# EAGLE design sensor-sm (EAGLE 6.1)
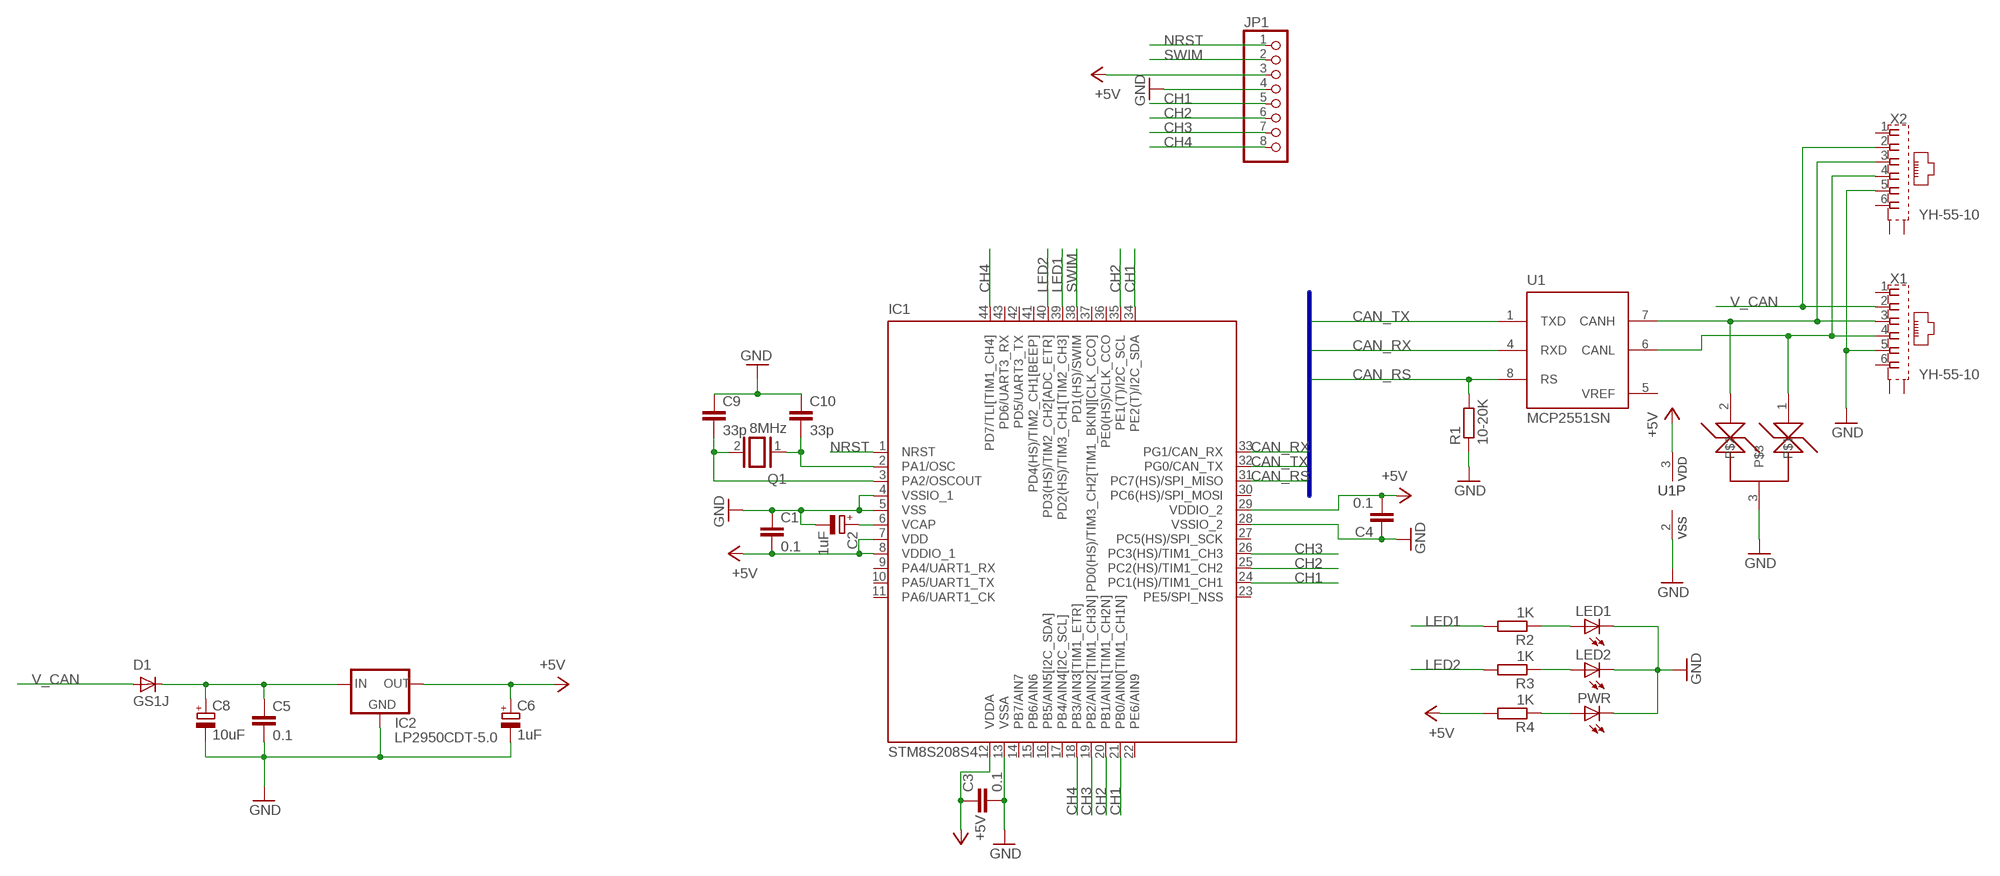
[diagram p0: schematic, sheet 1]

## Parts
C1  0.1  C-EUC0805K  [C0805K]
C2  1uF  CPOL-EUE2-4  [E2-4]
C3  0.1  C-EUC0805K  [C0805K]
C4  0.1  C-EUC0805K  [C0805K]
C5  0.1  C-EUC0805K  [C0805K]
C6  1uF  CPOL-EUE2-4  [E2-4]
C8  10uF  CPOL-EUE2-4  [E2-4]
C9  33p  C-EUC0805K  [C0805K]
C10  33p  C-EUC0805K  [C0805K]
D1  GS1J  GF1  [SMA-DO214AC]
IC1  STM8S208S4  [LQFP44-10X10]
IC2  LP2950CDT-5.0  [DPACK]
JP1  PINHD-1X8/90  [1X08/90]
LED1  LEDSML1206  [SML1206]
LED2  LEDSML1206  [SML1206]
NUP2105L  NUP2105L  [SOT23]
PWR  LEDSML1206  [SML1206]
Q1  8MHz  XTAL/S  [QS]
R1  10-20K  R-EU_R0805  [R0805]
R2  1K  R-EU_R0805  [R0805]
R3  1K  R-EU_R0805  [R0805]
R4  1K  R-EU_R0805  [R0805]
U1  MCP2551SN  [SO-08]
X1  YH-55-10  [YH-55-10]
X2  YH-55-10  [YH-55-10]

## Nets
+5V: C1.2 C3.1 C4.2 C6.+ IC1.7(VDD) IC1.8(VDDIO_1) IC1.12(VDDA) IC1.29(VDDIO_2) IC2.3(OUT) JP1.3 R4.2 U1.3(VDD)
CAN_RS: IC1.31(PC7(HS)/SPI_MISO) R1.2 U1.8(RS)
CAN_RX: IC1.33(PG1/CAN_RX) U1.4(RXD)
CAN_TX: IC1.32(PG0/CAN_TX) U1.1(TXD)
CH1: IC1.21(PB0/AIN0[TIM1_CH1N]) IC1.24(PC1(HS)/TIM1_CH1) IC1.34(PE2(T)/I2C_SDA) JP1.5
CH2: IC1.20(PB1/AIN1[TIM1_CH2N]) IC1.25(PC2(HS)/TIM1_CH2) IC1.35(PE1(T)/I2C_SCL) JP1.6
CH3: IC1.19(PB2/AIN2[TIM1_CH3N]) IC1.26(PC3(HS)/TIM1_CH3) JP1.7
CH4: IC1.18(PB3/AIN3[TIM1_ETR]) IC1.44(PD7/TLI[TIM1_CH4]) JP1.8
GND: C1.1 C2.- C3.2 C4.1 C5.2 C6.- C8.- C9.1 C10.1 IC1.4(VSSIO_1) IC1.5(VSS) IC1.13(VSSA) IC1.28(VSSIO_2) IC2.4(GND) JP1.4 LED1.C LED2.C NUP2105L.3 PWR.C R1.1 U1.2(VSS) X1.5 X2.5
LED1: IC1.39(PD2(HS)/TIM3_CH1[TIM2_CH3]) R2.2
LED2: IC1.40(PD3(HS)/TIM2_CH2[ADC_ETR]) R3.2
N$1: C2.+ IC1.6(VCAP)
N$3: C10.2 IC1.2(PA1/OSC) Q1.1
N$4: NUP2105L.1 U1.6(CANL) X1.4 X2.4
N$5: C9.2 IC1.3(PA2/OSCOUT) Q1.2
N$6: LED1.A R2.1
N$7: LED2.A R3.1
N$8: PWR.A R4.1
N$9: NUP2105L.2 U1.7(CANH) X1.3 X2.3
N$10: C5.1 C8.+ D1.K(C) IC2.1(IN)
NRST: IC1.1(NRST) JP1.1
SWIM: IC1.38(PD1(HS)/SWIM) JP1.2
V_CAN: D1.A X1.2 X2.2
Unconnected: IC1.9(PA4/UART1_RX) IC1.10(PA5/UART1_TX) IC1.11(PA6/UART1_CK) IC1.14(PB7/AIN7) IC1.15(PB6/AIN6) IC1.16(PB5/AIN5[I2C_SDA]) IC1.17(PB4/AIN4[I2C_SCL]) IC1.22(PE6/AIN9) IC1.23(PE5/SPI_NSS) IC1.27(PC5(HS)/SPI_SCK) IC1.30(PC6(HS)/SPI_MOSI) IC1.36(PE0(HS)/CLK_CCO) IC1.37(PD0(HS)/TIM3_CH2[TIM1_BKIN][CLK_CCO]) IC1.41(PD4(HS)/TIM2_CH1[BEEP]) IC1.42(PD5/UART3_TX) IC1.43(PD6/UART3_RX) X1.1 X1.6 X1.S1(S) X1.S2(S) X2.1 X2.6 X2.S1(S) X2.S2(S)

## Buses
CAN_TX,CAN_RX,CAN_RS

## Power pins joined to a net without a drawn wire
VREF: U1.5(VREF)

## Library data of the parts
C1 C3-C5 C9 C10 = rcl:C-EU: CAPACITOR, European symbol
C2 C6 C8 = rcl:CPOL-EU: POLARIZED CAPACITOR, European symbol
D1 = diode:GF1: DIODE
IC1 = stm8s208s:STM8S208S: Access line, 16 MHz STM8S 8-bit MCU up to 32 Kbytes Flash, integrated EEPROM,10-bit ADC, timers, UART, SPI, I²C Source: Data sheet <http://www.st.com/stonline/products/literature/ds/14771/stm8s105c4.pdf>; MPN: STM8S208S; OC_FARNELL: 1706227; OC_NEWARK: 09R6037
IC2 = v-reg:LP2950?*: Source: http://cache.national.com/ds/LP/LP2950.pdf
JP1 = pinhead:PINHD-1X8: PIN HEADER
LED1 LED2 PWR = led:LED: LED OSRAM: - CHIPLED LG R971, LG N971, LY N971, LG Q971, LY Q971, LO R971, LY R971 LH N974, LH R974 LS Q976, LO Q976, LY Q976 LO Q996 - Hyper CHIPLED LW Q18S LB Q993, LB Q99A, LB R99A - SideLED LS A670, LO A670, LY A670, LG A670, LP A670 LB A673, LV A673, LT A673, LW A673 LH A674 LY A675 LS A676, LA A676, LO A676, LY A676, LW A676 LS A679, LY A679, LG A679 - Hyper Micro SIDELED® LS Y876, LA Y876, LO Y876, LY Y876 LT Y87S - SmartLED LW L88C, LW L88S LB L89C, LB L89S, LG L890 LS L89K, LO L89K, LY L89K LS L896, LA L896, LO L896, LY L896 - TOPLED LS T670, LO T670, LY T670, LG T670, LP T670 LSG T670, LSP T670, LSY T670, LOP T670, LYG T670 LG T671, LOG T671, LSG T671 LB T673, LV T673, LT T673, LW T673 LH T674 LS T676, LA T676, LO T676, LY T676, LB T676, LH T676, LSB T676, LW T676 LB T67C, LV T67C, LT T67C, LS T67K, LO T67K, LY T67K, LW E67C LS E67B, LA E67B, LO E67B, LY E67B, LB E67C, LV E67C, LT E67C LW T67C LS T679, LY T679, LG T679 LS T770, LO T770, LY T770, LG T770, LP T770 LB T773, LV T773, LT T773, LW T773 LH T774 LS E675, LA E675, LY E675, LS T675 LS T776, LA T776, LO T776, LY T776, LB T776 LHGB T686 LT T68C, LB T68C - Hyper Mini TOPLED® LB M676 - Mini TOPLED Santana® LG M470 LS M47K, LO M47K, LY M47K Source: http://www.osram.convergy.de LUXEON: - LUMILED® LXK2-PW12-R00, LXK2-PW12-S00, LXK2-PW14-U00, LXK2-PW14-V00 LXK2-PM12-R00, LXK2-PM12-S00, LXK2-PM14-U00 LXK2-PE12-Q00, LXK2-PE12-R00, LXK2-PE12-S00, LXK2-PE14-T00, LXK2-PE14-U00 LXK2-PB12-K00, LXK2-PB12-L00, LXK2-PB12-M00, LXK2-PB14-N00, LXK2-PB14-P00, LXK2-PB14-Q00 LXK2-PR12-L00, LXK2-PR12-M00, LXK2-PR14-Q00, LXK2-PR14-R00 LXK2-PD12-Q00, LXK2-PD12-R00, LXK2-PD12-S00 LXK2-PH12-R00, LXK2-PH12-S00 LXK2-PL12-P00, LXK2-PL12-Q00, LXK2-PL12-R00 Source: www.luxeon.com KINGBRIGHT: KA-3528ASYC Source: www.kingbright.com
NUP2105L = transistor:NUP2105L
Q1 = special:XTAL/S: CRYSTAL
R1-R4 = rcl:R-EU_: RESISTOR, European symbol
U1 = microchip_can:MCP2551: High Speed CAN tranceiver
X1 X2 = con-wenzhou-yihua:YH-55-10: RJ11 6 connects Source: YH-55-10.pdf; OC_FARNELL: unknown; OC_NEWARK: unknown

## Board
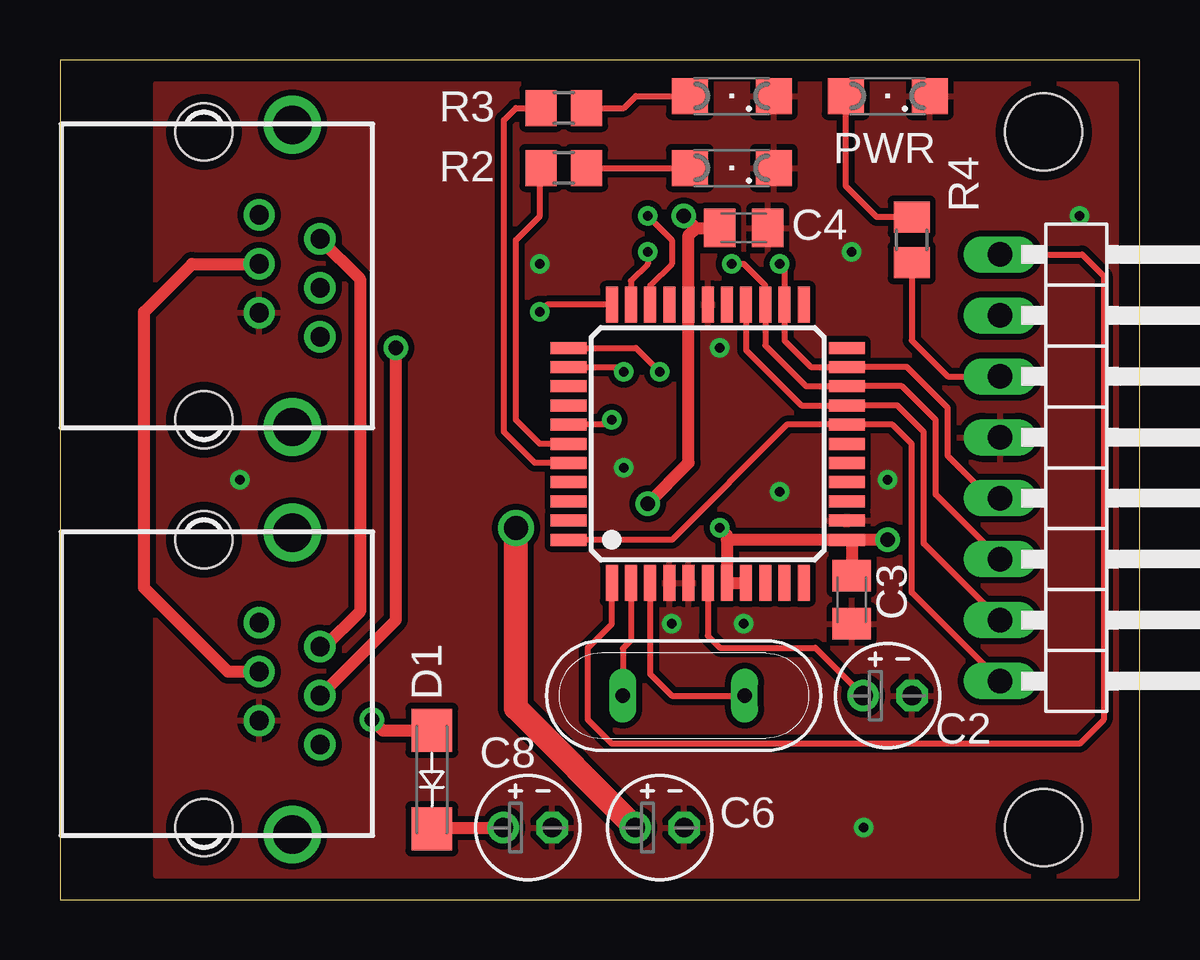
[diagram p1: board, top side]
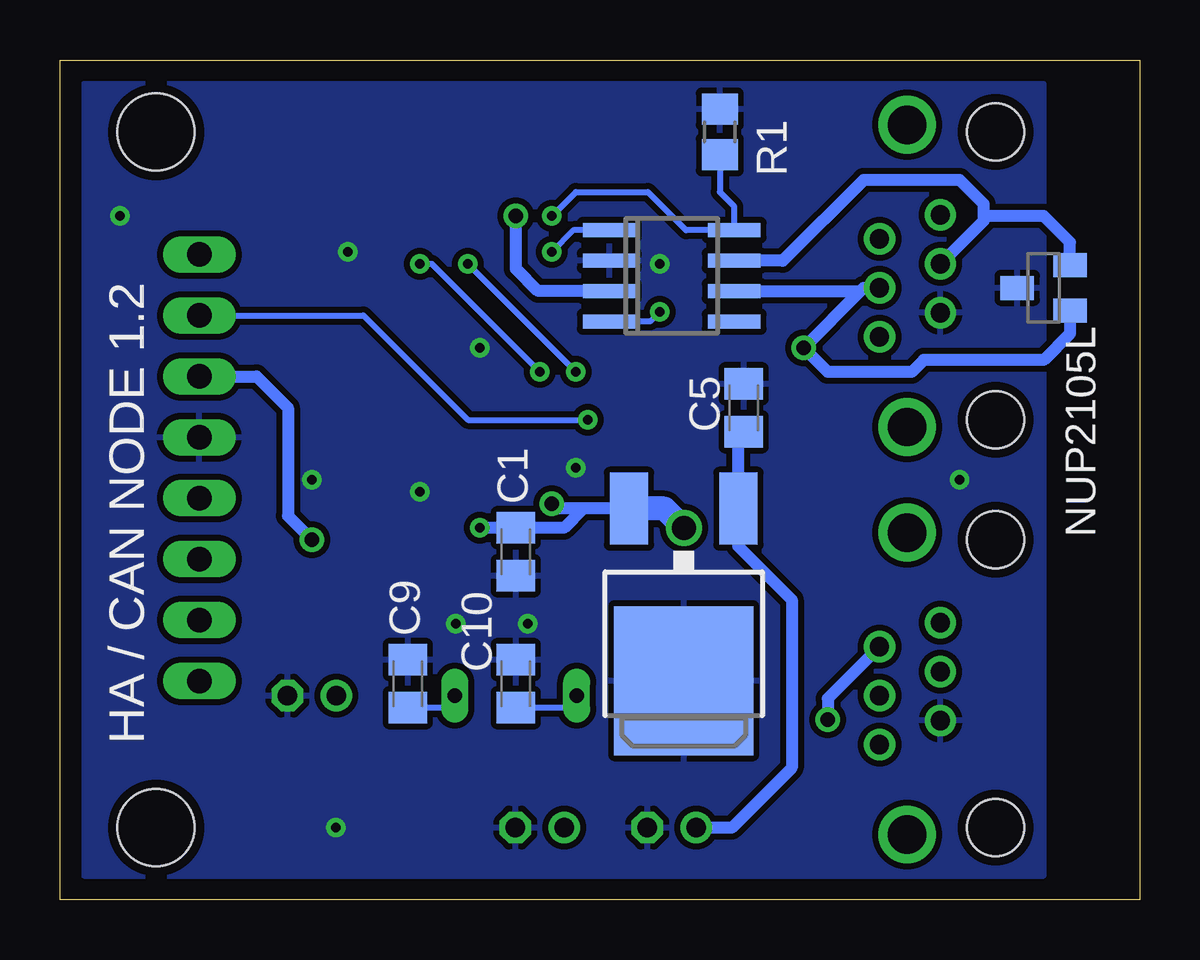
[diagram p2: board, bottom side, seen from below]

Size 45 x 35 mm. Coordinates in mm from the lower left corner, seen from the top.
Outline: 0,0 45,0 45,35 0,35 0,0
Copper layers (1*16): Top 0.035mm / dielectric 1.5mm / Bottom 0.035mm
Design rules: minimum track width 0.25mm, minimum drill 0.3mm, track to track 0.25mm, track to pad 0.25mm, pad to pad 0.25mm, via to via 0.25mm, smd to smd 0.25mm, copper to edge 0.4mm, drill to drill 0.25mm, minimum pad ring 10mil, minimum via ring 8mil, stop-mask expansion 0.1mm, vias tented up to drill 0.6mm, thermal gap 10mil
Holes 3.2 mm at 41,3 41,32

### Footprints (pad centres in the part's own frame; a part is rotated, then mirrored left to right if it is on the bottom)
C0805K = smd 1.3 x 1.6: 1 -1,0; 2 1,0
E2-4 = drill 0.813 pad 1.27: + -1.016,0 | drill 0.813 pad 1.27 octagon: - 1.016,0
SMA-DO214AC = smd 1.8 x 1.7: A -2.05,0; K 2.05,0
LQFP44-10X10 = smd 1.5 x 0.5: 1 -5.8,4; 2 -5.8,3.2; 3 -5.8,2.4; 4 -5.8,1.6; 5 -5.8,0.8; 6 -5.8,0; 7 -5.8,-0.8; 8 -5.8,-1.6; 9 -5.8,-2.4; 10 -5.8,-3.2; 11 -5.8,-4; 23 5.8,-4; 24 5.8,-3.2; 25 5.8,-2.4; 26 5.8,-1.6; 27 5.8,-0.8; 28 5.8,0; 29 5.8,0.8; 30 5.8,1.6; 31 5.8,2.4; 32 5.8,3.2; 33 5.8,4 | smd 0.5 x 1.5: 12 -4,-5.8; 13 -3.2,-5.8; 14 -2.4,-5.8; 15 -1.6,-5.8; 16 -0.8,-5.8; 17 0,-5.8; 18 0.8,-5.8; 19 1.6,-5.8; 20 2.4,-5.8; 21 3.2,-5.8; 22 4,-5.8; 34 4,5.8; 35 3.2,5.8; 36 2.4,5.8; 37 1.6,5.8; 38 0.8,5.8; 39 0,5.8; 40 -0.8,5.8; 41 -1.6,5.8; 42 -2.4,5.8; 43 -3.2,5.8; 44 -4,5.8
DPACK = smd 1.6 x 3: 1 -2.28,-4.8; 3 2.28,-4.8 | smd 5.8 x 6.2: 4 0,2.38
1X08/90 = drill 1.016 long: 1 -8.89,-3.81; 2 -6.35,-3.81; 3 -3.81,-3.81; 4 -1.27,-3.81; 5 1.27,-3.81; 6 3.81,-3.81; 7 6.35,-3.81; 8 8.89,-3.81
SML1206 = smd 1.5 x 1.5: A 1.75,0; C -1.75,0
SOT23 = smd 1 x 1.4: 1 -0.95,-1.1; 2 0.95,-1.1; 3 0,1.1
QS = drill 0.61 long: 1 -2.54,0; 2 2.54,0
R0805 = smd 1.3 x 1.5: 1 -0.95,0; 2 0.95,0
SO-08 = smd 0.6 x 2.2: 1 -1.905,-2.6; 2 -0.635,-2.6; 3 0.635,-2.6; 4 1.905,-2.6; 5 1.905,2.6; 6 0.635,2.6; 7 -0.635,2.6; 8 -1.905,2.6
YH-55-10 = drill 0.8 pad 1.3: 1 -2.54,2.3; 2 -1.54,4.84; 3 -0.5,2.3; 4 0.5,4.84; 5 1.54,2.3; 6 2.54,4.84 | drill 1.6 pad 2.184: S1 -6.3,3.68; S2 6.3,3.68 | hole 2.36: -6,0; 6,0

### Placement (x,y rotation side)
C1  26,14.5 90 bottom
C2  34.5,8.5 0 top
C3  33,12.5 270 top
C4  28.5,28 180 top
C5  16.5,20.5 90 bottom
C6  25,3 0 top
C8  19.5,3 0 top
C9  30.5,9 270 bottom
C10  26,9 270 bottom
D1  15.5,5 270 top
IC1  27,19 90 top
IC2  19,11.5 180 bottom
JP1  43,18 270 top
LED1  28,30.5 180 top
LED2  28,33.5 180 top
NUP2105L  4,25.5 90 bottom
PWR  34.5,33.5 180 top
Q1  26,8.5 0 top
R1  17.5,32 270 bottom
R2  21,30.5 180 top
R3  21,33 180 top
R4  35.5,27.5 270 top
U1  19.5,26 270 bottom
X1  6,9 270 top
X2  6,26 270 top

### Tracks (layer width: path | path; a pad name or v marks a point on that pad's centre or on a via)
+5V  (via drill 0.4, 0.6, 1)
  Top 0.25: 27.8,15.2 27.8,15 | R4.2 35.5,23.31 37,21.81 JP1.3
  Top 0.3: IC1.12 33,14.8
  Top 0.5: IC1.8 IC1.7 27.8,15 IC1.12 v34.5,15 | v27.5,15.5 27.8,15.2 | v24.5,16.5 26.2,18.2 IC1.29 26.2,27.7 26.5,28 | 26.5,28 C4.2 | v26,28.5 26.5,28 | 33,14.8 C3.1
  Top 1: C6.+ 19,7.98 v19,15.5
  Bottom 0.5: IC2.3 23.2,16.3 | 23.2,16.3 24,15.5 C1.2 v27.5,15.5 | 23.2,16.3 24.3,16.3 v24.5,16.5 | U1.3 25.07,25.36 26,26.3 v26,28.5 | JP1.3 36.81,21.81 35.5,20.5 35.5,16 v34.5,15
  Bottom 1: v19,15.5 19.8,16.3 IC2.3
CAN_RS  (via drill 0.4)
  Top 0.25: v24.5,28.5 25.5,27.5 25.5,26.5 24.6,25.6 IC1.31
  Bottom 0.25: v24.5,28.5 23.5,29.5 20.5,29.5 18.91,27.91 U1.8 16.9,28.9 17.5,29.5 R1.2
CAN_RX  (via drill 0.4)
  Top 0.25: IC1.33 20.3,24.8 v20,24.5
  Bottom 0.25: v20,24.5 20.41,24.09 U1.4
CAN_TX  (via drill 0.4)
  Top 0.25: IC1.32 23.8,25.8 24.5,26.5 v24.5,27
  Bottom 0.25: U1.1 23.59,27.91 v24.5,27
CH1  (via drill 0.4)
  Top 0.25: JP1.5 38.77,16.73 37,18.5 37,20.5 35.3,22.2 IC1.21 31.3,22.2 30.2,23.3 IC1.24 30.2,26.3 v30,26.5 | IC1.34 24,23 v25,22
  Bottom 0.25: v25,22 29.5,26.5 v30,26.5
CH2  (via drill 0.4)
  Top 0.25: JP1.6 36.5,16.88 36.5,20 35.1,21.4 IC1.20 31.1,21.4 29.4,23.1 IC1.25 29.4,25.6 28.5,26.5 v28,26.5 | IC1.35 23.3,22.2 v23.5,22
  Bottom 0.25: v23.5,22 v28,26.5
CH3
  Top 0.25: IC1.26 28.6,22.9 30.9,20.6 IC1.19 34.9,20.6 36,19.5 36,14.84 JP1.7
CH4
  Top 0.25: IC1.44 25.5,15 30.3,19.8 IC1.18 34.7,19.8 35.5,19 35.5,12.8 JP1.8
GND  (via drill 0.4)
  other vias: 27.5,23 30,17 34.5,17.5 33,27 42.5,28.5 25.5,11.5 23.5,18 28.5,11.5 7.5,17.5 33.5,3 20,26.5
  pour Top (isolate 0.25): 4,34 44,34 44,1 4,1
  pour Bottom (isolate 0.25): 4,34 44,34 44,1 4,1
LED1
  Top 0.25: IC1.39 20,19 19,20 19,27.5 20,28.5 20,30.45 R2.2
LED2
  Top 0.25: IC1.40 19.8,18.2 18.5,19.5 18.5,32.5 19,33 R3.2
N$1
  Top 0.25: IC1.6 27,11 27.5,10.5 31.48,10.5 C2.+
N$3
  Top 0.25: IC1.2 23.8,10.8 23.46,10.46 Q1.1
  Bottom 0.25: Q1.1 23.96,8 C10.2
N$4  (via drill 0.6)
  Top 0.5: X1.4 14,11.66 v14,23
  Bottom 0.5: 11.63,25.36 v14,23 13,22 9.5,22 9,22.5 4,22.5 2.9,23.6 NUP2105L.1 | X2.4 11.5,25.5 11.63,25.36 | U1.6 11.63,25.36
N$5
  Top 0.25: IC1.3 24.6,9.4 25.5,8.5 Q1.2
  Bottom 0.25: Q1.2 29.04,8 C9.2
N$6
  Top 0.25: R2.1 LED1.A
N$7
  Top 0.25: R3.1 23.5,33 24,33.5 LED2.A
N$8
  Top 0.25: R4.1 34.05,28.45 32.75,29.75 PWR.A
N$9
  Top 0.5: X1.3 7,9.5 3.5,13 3.5,24.5 5.5,26.5 X2.3
  Bottom 0.5: X2.3 6.5,28.3 6.5,28.5 | 6.5,28.5 6.5,29 7.5,30 11.5,30 14.87,26.64 U1.7 | NUP2105L.2 2.9,27.4 4,28.5 6.5,28.5
N$10
  Top 0.5: D1.K 15.55,3 C8.+
  Bottom 0.5: C8.+ 17,3 14.5,5.5 14.5,12.5 16.72,14.72 IC2.1 16.72,19.28 C5.1
NRST
  Top 0.25: JP1.1 42.61,26.89 43.5,26 43.5,7.5 42.5,6.5 23,6.5 22,7.5 22,10.5 23,11.5 IC1.1
SWIM  (via drill 0.4)
  Top 0.25: v23,20 22.8,19.8 IC1.38
  Bottom 0.25: JP1.2 32.35,24.35 28,20 v23,20
V_CAN  (via drill 0.6)
  Top 0.5: v13,7.5 13.45,7.05 D1.A | X2.2 12.5,25.88 12.5,12 11.04,10.54 X1.2
  Bottom 0.5: X1.2 13,8.38 v13,7.5

### Text on the board
bNames: HA / CAN NODE 1.2
tDocu: 2 | 1